# EAGLE design Laser_Teensy4 (EAGLE 9.6.2)

## Sheet 1 of 3
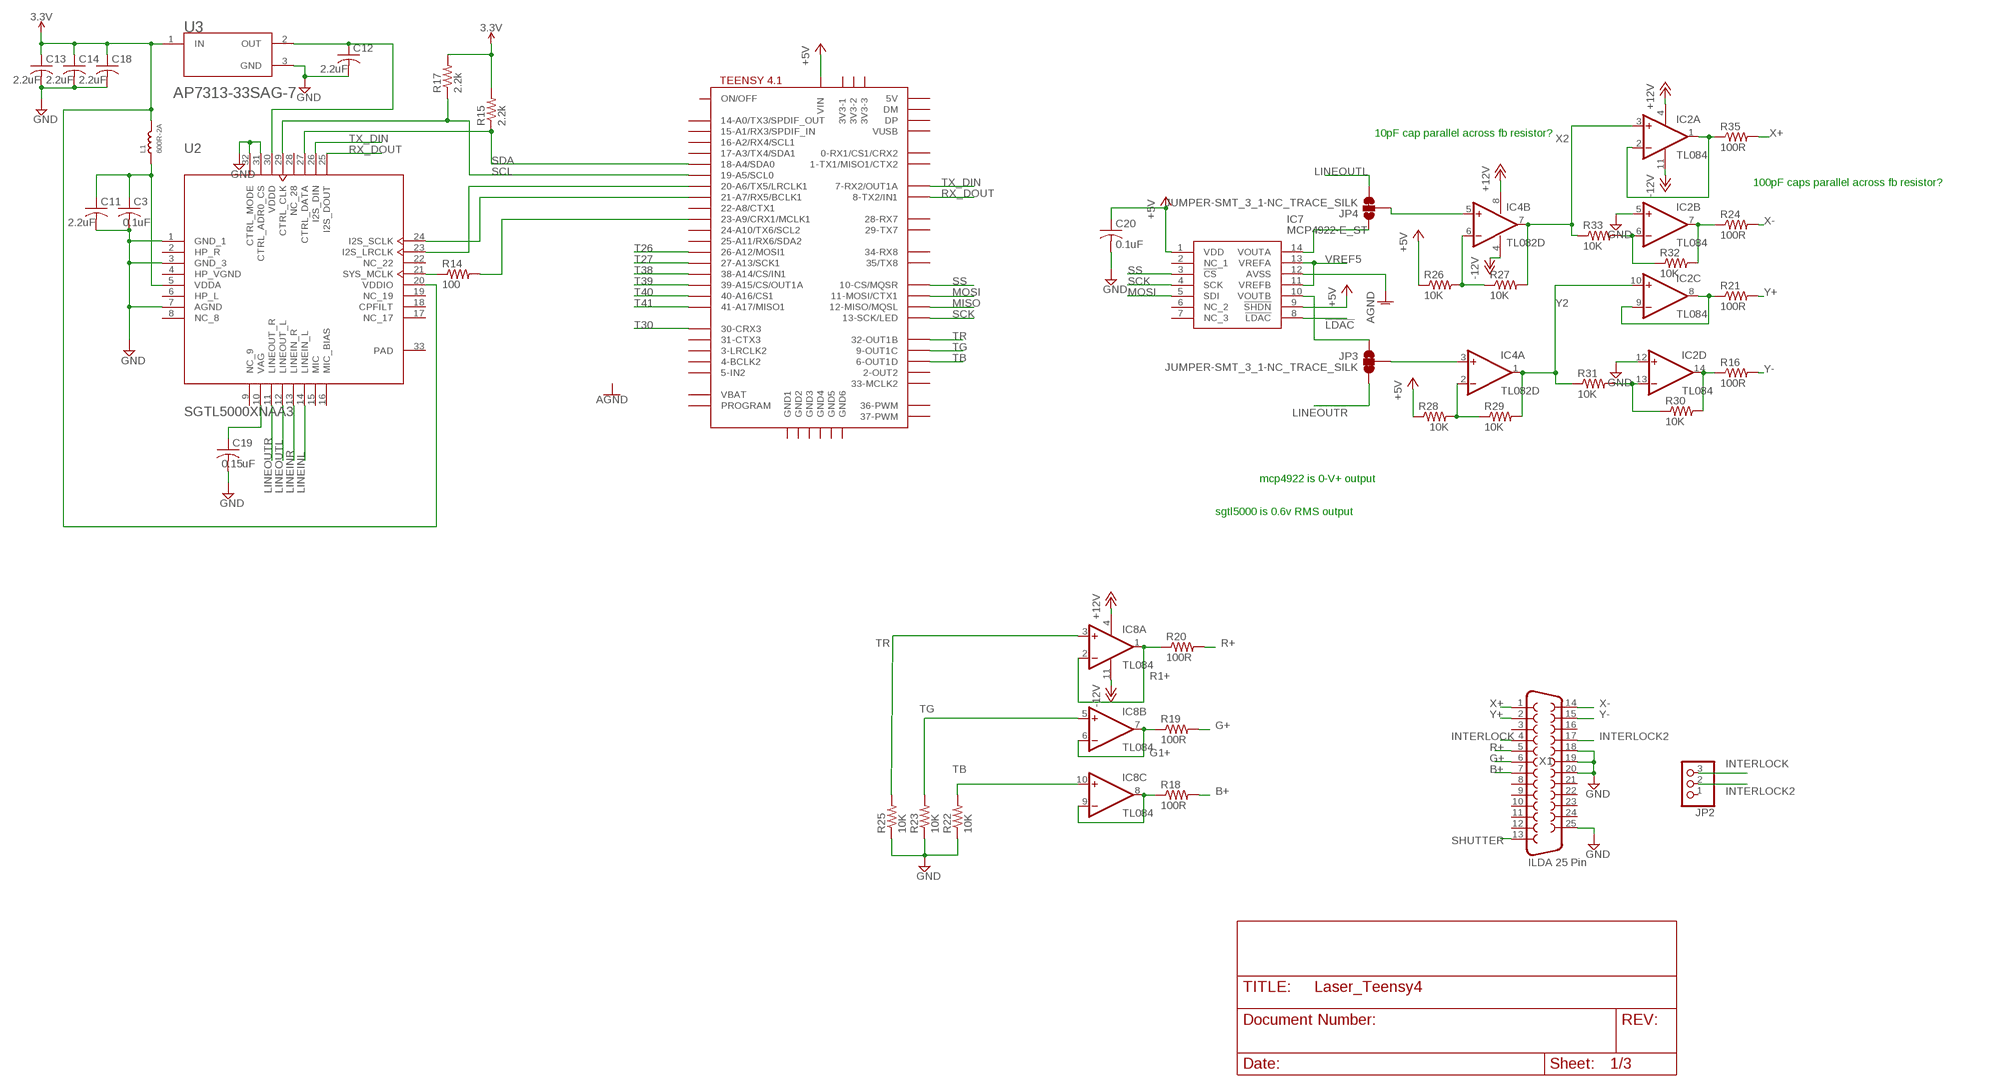
[diagram p0: schematic, sheet 1]

### Parts
C3  0.1uF  RCL_C-USC0603  [RCL_C0603]
C11  2.2uF  RCL_C-USC0603  [RCL_C0603]
C12  2.2uF  RCL_C-USC0603  [RCL_C0603]
C13  2.2uF  RCL_C-USC0603  [RCL_C0603]
C14  2.2uF  RCL_C-USC0603  [RCL_C0603]
C18  2.2uF  RCL_C-USC0603  [RCL_C0603]
C19  0.15uF  RCL_C-USC0603  [RCL_C0603]
C20  0.1uF  C-USC0603  [C0603]
IC2  TL084  [SOIC-14]
IC4  TL082D  [SO08]
IC7  MCP4922-E_ST  [SOP65P638X110-14N]
IC8  TL084  [SOIC-14]
JP2  PINHD-1X3  [1X03]
JP3  JUMPER-SMT_3_1-NC_TRACE_SILK  [SMT-JUMPER_3_1-NC_TRACE_SILK]
JP4  JUMPER-SMT_3_1-NC_TRACE_SILK  [SMT-JUMPER_3_1-NC_TRACE_SILK]
L1  600R-2A  SMD-FERRITE-BEAD-470R-2A(0805)'0805'  [L0805]
R14  100  R-US_R0603  [R0603]
R15  2.2k  R-US_R0603  [R0603]
R16  100R  R-US_R0603  [R0603]
R17  2.2k  R-US_R0603  [R0603]
R18  100R  R-US_R0603  [R0603]
R19  100R  R-US_R0603  [R0603]
R20  100R  R-US_R0603  [R0603]
R21  100R  R-US_R0603  [R0603]
R22  10K  R-US_R0603  [R0603]
R23  10K  R-US_R0603  [R0603]
R24  100R  R-US_R0603  [R0603]
R25  10K  R-US_R0603  [R0603]
R26  10K  R-US_R0603  [R0603]
R27  10K  R-US_R0603  [R0603]
R28  10K  R-US_R0603  [R0603]
R29  10K  R-US_R0603  [R0603]
R30  10K  R-US_R0603  [R0603]
R31  10K  R-US_R0603  [R0603]
R32  10K  R-US_R0603  [R0603]
R33  10K  R-US_R0603  [R0603]
R35  100R  R-US_R0603  [R0603]
U2  SGTL5000XNAA3  [QFN-32]
U3  DIODES_INC_AP7313-33SAG-7DIODES_INC_AP7313-33SAG-7_0_3  [DIODES_INC_AP7313-33SAG-7_3]
U$2  TEENSY41-E  [TENNSY41-E]
X1  ILDA 25 Pin  F25D  [F25D]

### Nets
3.3V [+3V3]: C13.1 C14.1 C18.1 L1.2 R15.2 R17.2 U2.20(VDDIO) U3.1(IN) ; also sheet 2
!LDAC: IC7.8(!LDAC)
+5V [power]: C20.1 IC7.1(VDD) IC7.9(!SHDN) R26.1 R28.1 U$2.VIN ; also sheet 3
+12V [power]: IC2.4(A:V+) IC4.8(P:V+) IC8.4(A:V+) ; also sheet 3
-12V [power]: IC2.11(A:V-) IC4.4(P:V-) IC8.11(A:V-) ; also sheet 3
AGND: IC7.12(AVSS) ; also sheet 3
B1+1: IC8.8(C:OUT) IC8.9(C:-IN) R18.1
B+: R18.2 X1.7
G1+: IC8.6(B:-IN) IC8.7(B:OUT) R19.1
G+: R19.2 X1.6
GND: C3.2 C11.2 C12.2 C13.2 C14.2 C18.2 C19.2 C20.2 IC2.5(B:+IN) IC2.12(D:+IN) R22.1 R23.1 R25.1 U2.1(GND_1) U2.3(GND_3) U2.7(AGND) U2.31(CTRL_ADR0_CS) U2.32(CTRL_MODE) U3.3(GND) X1.18 X1.19 X1.20 X1.25 ; also sheet 2,3
INTERLOCK: JP2.3 X1.4
INTERLOCK2: JP2.2 X1.17
LINEINL: U2.14(LINEIN_L)
LINEINR: U2.13(LINEIN_R)
LINEOUTL: JP4.3 U2.12(LINEOUT_L)
LINEOUTR: JP3.3 U2.11(LINEOUT_R)
MISO: U$2.12-MISO/MQSL
MOSI: IC7.5(SDI) U$2.11-MOSI/CTX1
N$1: IC7.14(VOUTA) JP4.1
N$2: IC7.10(VOUTB) JP3.1
N$9: C19.1 U2.10(VAG)
N$11: R14.2 U$2.23-A9/CRX1/MCLK1
N$12: C3.1 C11.1 L1.1 U2.5(VDDA)
N$13: U2.24(I2S_SCLK) U$2.21-A7/RX5/BCLK1
N$14: U2.23(I2S_LRCLK) U$2.20-A6/TX5/LRCLK1
N$15: R14.1 U2.21(SYS_MCLK)
N$16: C12.1 U2.30(VDDD) U3.2(OUT)
N$17: IC4.3(A:+IN) JP3.2
N$18: IC4.5(B:+IN) JP4.2
N$30: IC4.6(B:-IN) R26.2 R27.1
N$31: IC4.2(A:-IN) R28.2 R29.1
N$35: IC2.6(B:-IN) R32.1 R33.2
N$36: IC2.13(D:-IN) R30.1 R31.2
R1+: IC8.1(A:OUT) IC8.2(A:-IN) R20.1
R+: R20.2 X1.5
RX_DOUT: U2.25(I2S_DOUT) U$2.8-TX2/IN1
SCK: IC7.4(SCK) U$2.13-SCK/LED
SCL: R17.1 U2.29(CTRL_CLK) U$2.19-A5/SCL0
SDA: R15.1 U2.27(CTRL_DATA) U$2.18-A4/SDA0
SHUTTER: X1.13
SS: IC7.3(!CS) U$2.10-CS\MQSR(10-CS/MQSR)
T26: U$2.26-A12/MOSI1 ; also sheet 2
T27: U$2.27-A13/SCK1 ; also sheet 2
T30: U$2.30-CRX3 ; also sheet 2
T38: U$2.38-A14/CS/IN1 ; also sheet 2
T39: U$2.39-A15/CS/OUT1A ; also sheet 2
T40: U$2.40-A16/CS1 ; also sheet 2
T41: U$2.41-A17/MISO1 ; also sheet 2
TB: IC8.10(C:+IN) R22.2 U$2.6-OUT1D
TG: IC8.5(B:+IN) R23.2 U$2.9-OUT1C
TR: IC8.3(A:+IN) R25.2 U$2.32-OUT1B
TX_DIN: U2.26(I2S_DIN) U$2.7-RX2/OUT1A
VREF5 [power]: IC7.11(VREFB) IC7.13(VREFA) ; also sheet 3
X1+: IC2.1(A:OUT) IC2.2(A:-IN) R35.1
X1-: IC2.7(B:OUT) R24.1 R32.2
X2: IC2.3(A:+IN) IC4.7(B:OUT) R27.2 R33.1
X+: R35.2 X1.1
X-: R24.2 X1.14
Y1+: IC2.8(C:OUT) IC2.9(C:-IN) R21.1
Y1-: IC2.14(D:OUT) R16.1 R30.2
Y2: IC2.10(C:+IN) IC4.1(A:OUT) R29.2 R31.1
Y+: R21.2 X1.2
Y-: R16.2 X1.15
Unconnected: IC7.2(NC_1) IC7.6(NC_2) IC7.7(NC_3) IC8.12(D:+IN) IC8.13(D:-IN) IC8.14(D:OUT) JP2.1 U2.2(HP_R) U2.6(HP_L) U2.8(NC_8) U2.9(NC_9) U2.15(MIC) U2.16(MIC_BIAS) U2.17(NC_17) U2.18(CPFILT) U2.19(NC_19) U2.22(NC_22) U2.28(NC_28) U$2.0-RX1/CS1/CRX2 U$2.1-TX1/MISO1/CTX2 U$2.2-OUT2 U$2.3-LRCLK2 U$2.3V3-1 U$2.3V3-2 U$2.3V3-3 U$2.4-BCLK2 U$2.5-IN2 U$2.14-A0/TX3/SPDIF_OUT U$2.15-A1/RX3/SPDIF_IN U$2.16-A2/RX4/SCL1 U$2.17-A3/TX4/SDA1 U$2.22-A8/CTX1 U$2.24-A10/TX6/SCL2 U$2.25-A11/RX6/SDA2 U$2.28-RX7 U$2.29-TX7 U$2.31-CTX3 U$2.33-MCLK2 U$2.34-RX8 U$2.35-TX8(35/TX8) U$2.36-PWM U$2.37-PWM U$2.+5V(5V) U$2.DM U$2.DP U$2.GND1 U$2.GND2 U$2.GND3 U$2.GND4 U$2.GND5 U$2.GND6 U$2.ON/OFF U$2.PROGRAM U$2.VBAT U$2.VUSB X1.3 X1.8 X1.9 X1.10 X1.11 X1.12 X1.16 X1.21 X1.22 X1.23 X1.24

### Notes on the sheet
- 10pF cap parallel across fb resistor?
- 100pF caps parallel across fb resistor?
- mcp4922 is 0-V+ output
- sgtl5000 is 0.6v RMS output

## Sheet 2 of 3
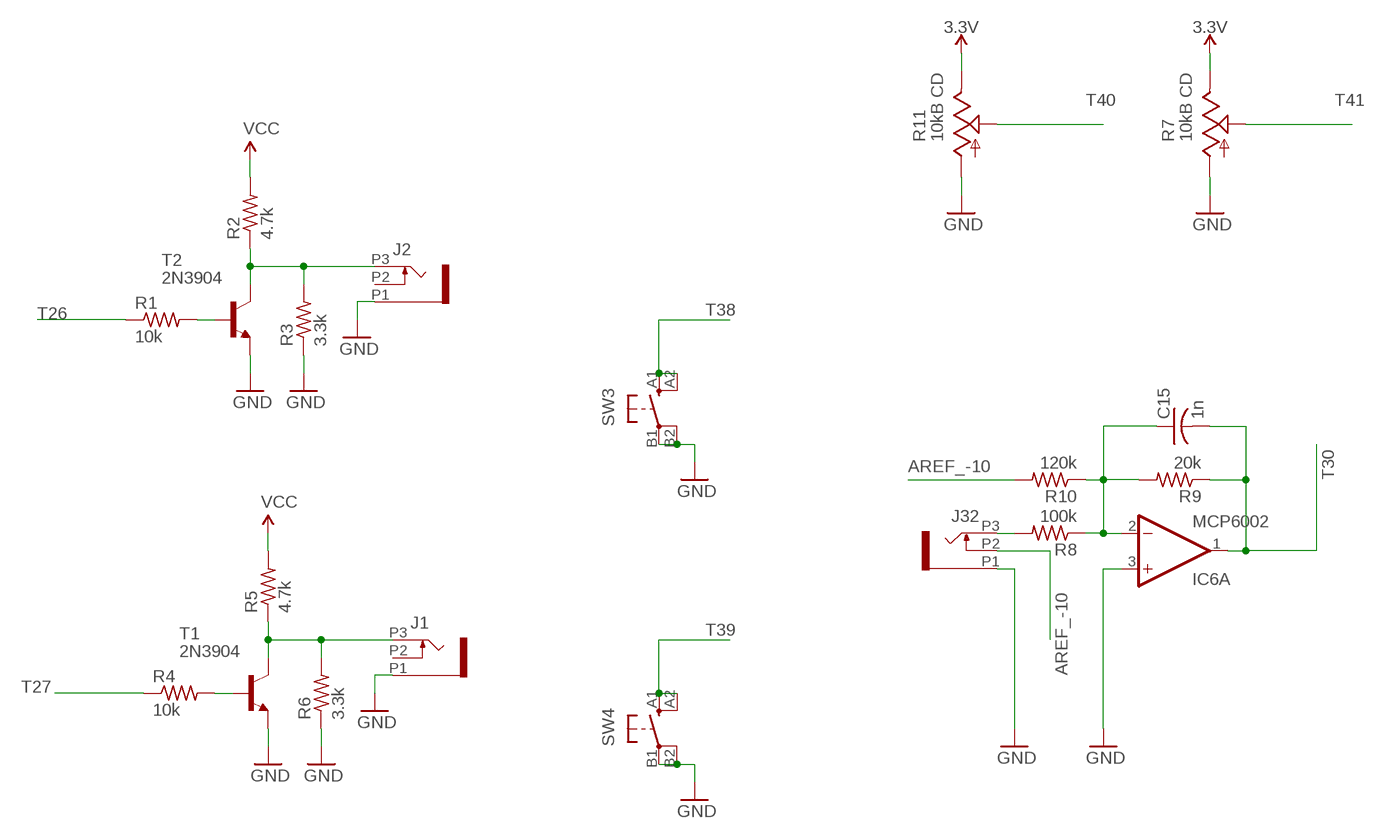
[diagram p1: schematic, sheet 2]

### Parts
C15  1n  C-US050-025X075  [C050-025X075]
IC6  MCP6002  TL072D  [SO08]
J1  PJ301_THONKICONN6  [WQP_PJ_301M6]
J2  PJ301_THONKICONN6  [WQP_PJ_301M6]
J32  PJ301_THONKICONN6  [WQP_PJ_301M6]
R1  10k  R-US_0204/7  [0204/7]
R2  4.7k  R-US_0204/7  [0204/7]
R3  3.3k  R-US_0204/7  [0204/7]
R4  10k  R-US_0204/7  [0204/7]
R5  4.7k  R-US_0204/7  [0204/7]
R6  3.3k  R-US_0204/7  [0204/7]
R7  10kB CD  POT_USVERTICAL_PS  [ALPS_POT_VERTICAL_PS]
R8  100k  R-US_0204/7  [0204/7]
R9  20k  R-US_0204/7  [0204/7]
R10  120k  R-US_0204/7  [0204/7]
R11  10kB CD  POT_USVERTICAL_PS  [ALPS_POT_VERTICAL_PS]
SW3  D6R  [D6R]
SW4  D6R  [D6R]
T1  2N3904  [TO92]
T2  2N3904  [TO92]

### Nets
3.3V [+3V3]: R7.P$1(E) R11.P$1(E) ; also sheet 1
AREF_-10 [-10V]: J32.P2 R10.2
GND: IC6.3(A:+IN) J1.P1 J2.P1 J32.P1 R3.1 R6.1 R7.P$3(A) R11.P$3(A) SW3.B1(P) SW3.B2(P1) SW4.B1(P) SW4.B2(P1) T1.3(E) T2.3(E) ; also sheet 1,3
N$3: R1.2 T2.2(B)
N$4: R4.2 T1.2(B)
N$5: J1.P3 R5.1 R6.2 T1.1(C)
N$6: C15.1 IC6.2(A:-IN) R8.1 R9.2 R10.1
N$20: J2.P3 R2.1 R3.2 T2.1(C)
N$34: J32.P3 R8.2
T26: R1.1 ; also sheet 1
T27: R4.1 ; also sheet 1
T30: C15.2 IC6.1(A:OUT) R9.1 ; also sheet 1
T38: SW3.A1(S) SW3.A2(S1) ; also sheet 1
T39: SW4.A1(S) SW4.A2(S1) ; also sheet 1
T40: R11.P$2(S) ; also sheet 1
T41: R7.P$2(S) ; also sheet 1
VCC [VCC]: R2.2 R5.2
Unconnected: IC6.5(B:+IN) IC6.6(B:-IN) IC6.7(B:OUT) J1.P2 J2.P2

## Sheet 3 of 3
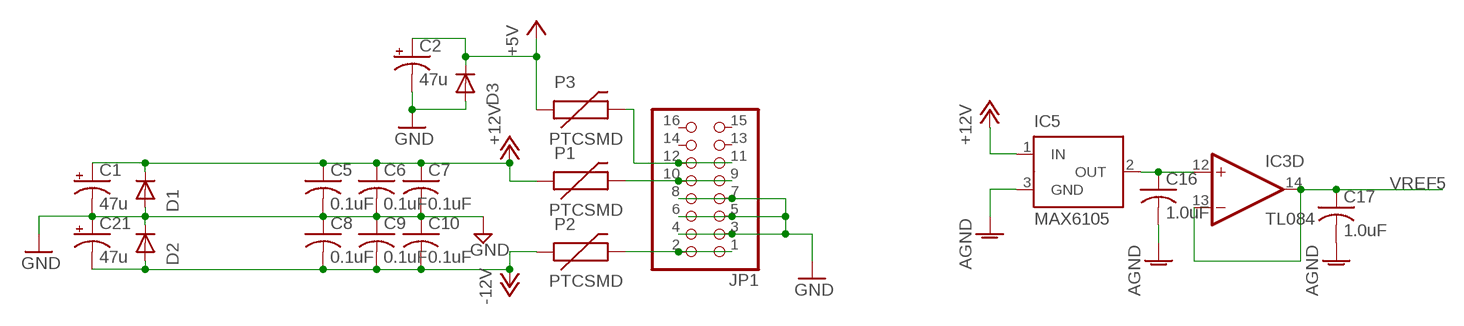
[diagram p2: schematic, sheet 3]

### Parts
C1  47u  CPOL-USD  [PANASONIC_D]
C2  47u  CPOL-USD  [PANASONIC_D]
C5  0.1uF  C-USC0603  [C0603]
C6  0.1uF  C-USC0603  [C0603]
C7  0.1uF  C-USC0603  [C0603]
C8  0.1uF  C-USC0603  [C0603]
C9  0.1uF  C-USC0603  [C0603]
C10  0.1uF  C-USC0603  [C0603]
C16  1.0uF  C-US025-024X044  [C025-024X044]
C17  1.0uF  C-US025-024X044  [C025-024X044]
C21  47u  CPOL-USD  [PANASONIC_D]
D1  1N5819HW  DIODE-SOD123  [SOD123]
D2  1N5819HW  DIODE-SOD123  [SOD123]
D3  1N5819HW  DIODE-SOD123  [SOD123]
IC3  TL084  [SOIC-14]
IC5  MAX6105  MAX6520  [SOT23]
JP1  PINHD-2X8  [2X08]
P1  PTCSMD  [PTC-1206]
P2  PTCSMD  [PTC-1206]
P3  PTCSMD  [PTC-1206]

### Nets
+5V [power]: C2.+ D3.C P3.1 ; also sheet 1
+12V [power]: C1.+ C5.1 C6.1 C7.1 D1.C IC5.1(IN) P1.1 ; also sheet 1
-12V [power]: C8.2 C9.2 C10.2 C21.- D2.A P2.1 ; also sheet 1
AGND: C16.2 C17.2 IC5.3(GND) ; also sheet 1
GND: C1.- C2.- C5.2 C6.2 C7.2 C8.1 C9.1 C10.1 C21.+ D1.A D2.C D3.A JP1.3 JP1.4 JP1.5 JP1.6 JP1.7 JP1.8 ; also sheet 1,2
N$7: JP1.1 JP1.2 P2.2
N$8: JP1.9 JP1.10 P1.2
N$10: JP1.11 JP1.12 P3.2
N$25: C16.1 IC3.12(D:+IN) IC5.2(OUT)
VREF5 [power]: C17.1 IC3.13(D:-IN) IC3.14(D:OUT) ; also sheet 1
Unconnected: IC3.1(A:OUT) IC3.2(A:-IN) IC3.3(A:+IN) IC3.5(B:+IN) IC3.6(B:-IN) IC3.7(B:OUT) IC3.8(C:OUT) IC3.9(C:-IN) IC3.10(C:+IN) JP1.13 JP1.14 JP1.15 JP1.16

## Power pins joined to a net without a drawn wire
HP_VGND: U2.4(HP_VGND)
PAD: U2.33(PAD)
V+: IC3.4(A:V+) IC6.8(P:V+)
V-: IC3.11(A:V-) IC6.4(P:V-)

## Library data of the parts
C1 C2 C21 = rcl:CPOL-US: POLARIZED CAPACITOR, American symbol
C3 C11-C14 C18 C19 = Freak_Select_1.01:RCL_C-US: CAPACITOR, American symbol; SPICEPREFIX: C
C5-C10 C16 C17 C20 = adafruit:C-US: CAPACITOR, American symbol
C15 = rcl:C-US: CAPACITOR, American symbol; SPICEPREFIX: C
D1-D3 = diode:DIODE-: DIODE
IC2 IC3 IC8 = favreau:TL084: Texas Instruments TL084 JFET General Purpose Op-Amp
IC4 = linear:TL082: OP AMP
IC5 = maxim:MAX6520: 1.2V Voltage Reference 50ppm/°C, SOT23, 3-Terminal Source: http://datasheets.maxim-ic.com/en/ds/MAX6520.pdf
IC6 = linear:TL072: OP AMP
IC7 = SamacSys_Parts:MCP4922-E_ST: Microchip MCP4922-E/ST, 2-channel 12 bit Serial DAC, 14-Pin TSSOP Source: Datasheet <http://componentsearchengine.com/Datasheets/3/MCP4922-E_ST.pdf>; ARROW_PART_NUMBER: MCP4922-E/ST; ARROW_PRICE-STOCK: https://www.arrow.com/en/products/mcp4922-est/microchip-technology; DESCRIPTION: Microchip MCP4922-E/ST, 2-channel 12 bit Serial DAC, 14-Pin TSSOP; HEIGHT: 1.1mm; MANUFACTURER_NAME: Microchip; MANUFACTURER_PART_NUMBER: MCP4922-E/ST; MOUSER_PART_NUMBER: 579-MCP4922-E/ST; MOUSER_PRICE-STOCK: https://www.mouser.co.uk/ProductDetail/Microchip-Technology/MCP4922-E-ST?qs=iRhCjdSJZe6gRerFwLixKQ%3D%3D
J1 J2 J32 = og-pj301_variations:PJ301_THONKICONN
JP1 = pinhead:PINHD-2X8: PIN HEADER
JP2 = pinhead:PINHD-1X3: PIN HEADER
JP3 JP4 = SparkFun-Jumpers:JUMPER-SMT_3_1-NC_TRACE: Normally closed trace jumper (1 of 2 connections) This jumper has a trace between two pads so it's normally closed (NC). The other connection is normally open (NO). Use a razor knife to open the connection. For best results follow the IPC guidelines for cutting traces: Cutout at least 0.063 mm (0.005 in). Remove all loose material to clean up the cut area. Seal the cut with an approved epoxy. Reapply solder to reclose the connection, or to close the NO connection.
L1 = OPL_Ferrite_and_Magnetic_Bead:SMD-FERRITE-BEAD-470R-2A(0805): 303030008; MPN: WLB2012-471T20; VALUE: 470R-2A
P1-P3 = SparkFun:PTC: Resettable Fuse PTC Resettable Fuse. Spark Fun Electronics SKU : COM-08357
R1-R6 R8-R10 = rcl:R-US_: RESISTOR, American symbol; SPICEPREFIX: R
R7 R11 = pot-alps:POT_US
R14-R33 R35 = resistor:R-US_: RESISTOR, American symbol
SW3 SW4 = og-switch:D6R: C&K D6R
T1 T2 = transistor:2N3904: NPN TRANSISTOR
U2 = IC:SGTL5000XNAA3: IC AUDIO CODEC STEREO 32-QFN Manufacturer's datasheet <http://cache.freescale.com/files/analog/doc/data_sheet/SGTL5000.pdf>; CREATED_BY: PCBLayout.com; DIGIKEY_PART_NUMBER: SGTL5000XNAA3-ND; MANUFACTURER: NXP USA Inc.; MPN: SGTL5000XNAA3; PACKAGE: 32-QFN-EP
U3 = Diodes Inc. - AP7313-33SAG-7:DIODES_INC_AP7313-33SAG-7: IC REG LINEAR 3.3V 150MA SOT23-3; ACCURACY_PERCENTAGE: 2%; AMBIENT_TEMPERATURE_RANGE_HIGH: +85°C; AMBIENT_TEMPERATURE_RANGE_LOW: -40°C; AUTOMOTIVE: No; CENTROID_NOT_SPECIFIED: No; DATASHEET: https://www.diodes.com/assets/Datasheets/AP7313.pdf; DEVICE_CLASS_L1: Integrated Circuits (ICs); DEVICE_CLASS_L2: Power Management ICs; DEVICE_CLASS_L3: Voltage Regulators - Linear; DIGIKEY_DESCRIPTION: IC REG LINEAR 3.3V 150MA SOT23-3; DIGIKEY_PART_NUMBER: AP7313-33SAG-7DICT-ND; DROPOUT_VOLTAGE: 150mV; FOOTPRINT_PARAMETERS_1: {"fp_type":"SOT23","params":{"N":{"default":"3","long name":"Number of leads","type":"multichoice","short name":"N"},"A":{"nom":1024999,"long name":"Height","min":903000,"max":1100000,"short name":"A","type":"measurement"},"A1":{"nom":50000,"long name":"Package clearance","min":13000,"max":100000,"short name":"A1","type":"measurement"},"A2":{"nom":975000,"long name":"Package height","min":890000,"max":1000000,"short name":"A2","type":"measurement"},"D":{"nom":2900000,"long name":"Package length","min":2800000,"max":3000000,"short name":"D","type":"measurement"},"E":{"nom":2400000,"long name":"Width /w leads","min":2300000,"max":2500000,"short name":"E","type":"measurement"},"E1":{"nom":1300000,"long name":"Package width","min":1200000,"max":1400000,"short name":"E1","type":"measurement"},"B":{"nom":400000,"long name":"Lead width","min":370000,"max":510000,"short name":"B","type":"measurement"},"C":{"nom":110000,"long name":"Lead thickness","min":85000,"max":150000,"short name":"C","type":"measurement"},"L":{"nom":400000,"long name":"Lead foot length","min":250000,"max":550000,"short name":"L","type":"measurement"},"e":{"nom":915000,"long name":"Lead pitch","min":null,"max":null,"short name":"e","type":"measurement"},"PHI":{"nom":false,"long name":"Lead angle","min":0,"max":8,"short name":"PHI","type":"measurement"},"offset x":{"nom":0,"long name":"X Center offset","min":null,"max":null,"short name":"offset x","type":"measurement"},"offset y":{"nom":0,"long name":"Y Center offset","min":null,"max":null,"short name":"offset y","type":"measurement"},"LS":{"default":"Rounded rectangle","long name":"Land shape","type":"multichoice","short name":"LS"},"LS1":{"default":"Rectangle","long name":"Land shape (Pin 1)","type":"multichoice","short name":"LS1"},"solder toe":{"nom":550000,"long name":"Solder fillet (toe)","min":null,"max":null,"short name":"solder toe","type":"fixedmeasurement"},"solder heel":{"nom":450000,"long name":"Solder fillet (heel)","min":null,"max":null,"short name":"solder heel","type":"fixedmeasurement"},"solder side":{"nom":50000,"long name":"Solder fillet (side)","min":null,"max":null,"short name":"solder side","type":"fixedmeasurement"},"courtyard":{"nom":500000,"long name":"Courtyard","min":null,"max":null,"short name":"courtyard","type":"fixedmeasurement"},"SF":{"default":"A","long name":"Packing level","type":"multichoiceparent","short name":"SF","help":"http://support.upverter.com/customer/portal/articles/978783-what-is-a-footprint-packing-level","children":["solder toe","solder heel","solder side","courtyard"]}}}; FOOTPRINT_PARAMETERS_2: {"fp_type":"SOT23","params":{"N":{"default":"3","long name":"Number of leads","type":"multichoice","short name":"N"},"A":{"nom":1024999,"long name":"Height","min":903000,"max":1100000,"short name":"A","type":"measurement"},"A1":{"nom":50000,"long name":"Package clearance","min":13000,"max":100000,"short name":"A1","type":"measurement"},"A2":{"nom":975000,"long name":"Package height","min":890000,"max":1000000,"short name":"A2","type":"measurement"},"D":{"nom":2900000,"long name":"Package length","min":2800000,"max":3000000,"short name":"D","type":"measurement"},"E":{"nom":2400000,"long name":"Width /w leads","min":2300000,"max":2500000,"short name":"E","type":"measurement"},"E1":{"nom":1300000,"long name":"Package width","min":1200000,"max":1400000,"short name":"E1","type":"measurement"},"B":{"nom":400000,"long name":"Lead width","min":370000,"max":510000,"short name":"B","type":"measurement"},"C":{"nom":110000,"long name":"Lead thickness","min":85000,"max":150000,"short name":"C","type":"measurement"},"L":{"nom":400000,"long name":"Lead foot length","min":250000,"max":550000,"short name":"L","type":"measurement"},"e":{"nom":915000,"long name":"Lead pitch","min":null,"max":null,"short name":"e","type":"measurement"},"PHI":{"nom":false,"long name":"Lead angle","min":0,"max":8,"short name":"PHI","type":"measurement"},"offset x":{"nom":0,"long name":"X Center offset","min":null,"max":null,"short name":"offset x","type":"measurement"},"offset y":{"nom":0,"long name":"Y Center offset","min":null,"max":null,"short name":"offset y","type":"measurement"},"LS":{"default":"Rounded rectangle","long name":"Land shape","type":"multichoice","short name":"LS"},"LS1":{"default":"Rectangle","long name":"Land shape (Pin 1)","type":"multichoice","short name":"LS1"},"solder toe":{"nom":350000,"long name":"Solder fillet (toe)","min":null,"max":null,"short name":"solder toe","type":"fixedmeasurement"},"solder heel":{"nom":350000,"long name":"Solder fillet (heel)","min":null,"max":null,"short name":"solder heel","type":"fixedmeasurement"},"solder side":{"nom":30000,"long name":"Solder fillet (side)","min":null,"max":null,"short name":"solder side","type":"fixedmeasurement"},"courtyard":{"nom":250000,"long name":"Courtyard","min":null,"max":null,"short name":"courtyard","type":"fixedmeasurement"},"SF":{"default":"B","long name":"Packing level","type":"multichoiceparent","short name":"SF","help":"http://support.upverter.com/customer/portal/articles/978783-what-is-a-footprint-packing-level","children":["solder toe","solder heel","solder side","courtyard"]}}}; FOOTPRINT_PARAMETERS_3: {"fp_type":"SOT23","params":{"N":{"default":"3","long name":"Number of leads","type":"multichoice","short name":"N"},"A":{"nom":1024999,"long name":"Height","min":903000,"max":1100000,"short name":"A","type":"measurement"},"A1":{"nom":50000,"long name":"Package clearance","min":13000,"max":100000,"short name":"A1","type":"measurement"},"A2":{"nom":975000,"long name":"Package height","min":890000,"max":1000000,"short name":"A2","type":"measurement"},"D":{"nom":2900000,"long name":"Package length","min":2800000,"max":3000000,"short name":"D","type":"measurement"},"E":{"nom":2400000,"long name":"Width /w leads","min":2300000,"max":2500000,"short name":"E","type":"measurement"},"E1":{"nom":1300000,"long name":"Package width","min":1200000,"max":1400000,"short name":"E1","type":"measurement"},"B":{"nom":400000,"long name":"Lead width","min":370000,"max":510000,"short name":"B","type":"measurement"},"C":{"nom":110000,"long name":"Lead thickness","min":85000,"max":150000,"short name":"C","type":"measurement"},"L":{"nom":400000,"long name":"Lead foot length","min":250000,"max":550000,"short name":"L","type":"measurement"},"e":{"nom":915000,"long name":"Lead pitch","min":null,"max":null,"short name":"e","type":"measurement"},"PHI":{"nom":false,"long name":"Lead angle","min":0,"max":8,"short name":"PHI","type":"measurement"},"offset x":{"nom":0,"long name":"X Center offset","min":null,"max":null,"short name":"offset x","type":"measurement"},"offset y":{"nom":0,"long name":"Y Center offset","min":null,"max":null,"short name":"offset y","type":"measurement"},"LS":{"default":"Rounded rectangle","long name":"Land shape","type":"multichoice","short name":"LS"},"LS1":{"default":"Rectangle","long name":"Land shape (Pin 1)","type":"multichoice","short name":"LS1"},"solder toe":{"nom":150000,"long name":"Solder fillet (toe)","min":null,"max":null,"short name":"solder toe","type":"fixedmeasurement"},"solder heel":{"nom":250000,"long name":"Solder fillet (heel)","min":null,"max":null,"short name":"solder heel","type":"fixedmeasurement"},"solder side":{"nom":10000,"long name":"Solder fillet (side)","min":null,"max":null,"short name":"solder side","type":"fixedmeasurement"},"courtyard":{"nom":100000,"long name":"Courtyard","min":null,"max":null,"short name":"courtyard","type":"fixedmeasurement"},"SF":{"default":"C","long name":"Packing level","type":"multichoiceparent","short name":"SF","help":"http://support.upverter.com/customer/portal/articles/978783-what-is-a-footprint-packing-level","children":["solder toe","solder heel","solder side","courtyard"]}}}; FOOTPRINT_URL: https://www.diodes.com/assets/Package-Files/SOT23.pdf; FOOTPRINT_VARIANT_NAME_0: Recommended_Land_Pattern; FOOTPRINT_VARIANT_NAME_1: IPC_A; FOOTPRINT_VARIANT_NAME_2: IPC_B; FOOTPRINT_VARIANT_NAME_3: IPC_C; HEIGHT: 1.1mm; LEAD_FREE: Yes; MAX_JUNCTION_TEMP: +125°C; MAX_POWER_DISSIPATION: 600mW; MAX_SUPPLY_VOLTAGE: 6V; MF: Diodes Inc.; MFG_PACKAGE_IDENT: SOT23; MFG_PACKAGE_IDENT_COMPONENT_ID: 395c052727f488cf; MFG_PACKAGE_IDENT_DATE: 01/2017; MFG_PACKAGE_IDENT_REV: 0; MIN_SUPPLY_VOLTAGE: 2V; MOUSER_DESCRIPTION: LDO Voltage Regulators LDO SOT-23 3.3V/150MA; MOUSER_PART_NUMBER: 621-AP7313-33SAG-7; MPN: AP7313-33SAG-7; NOMINAL_SUPPLY_CURRENT: 55-65uA; NUMBER_OF_OUTPUTS: 1; OUTPUT_CURRENT: 150mA; OUTPUT_TYPE: Fixed; OUTPUT_VOLTAGE: 3.3V; PACKAGE: SOT23; PREFIX: U; ROHS: Yes; STANDOFF_HEIGHT: 0.013mm; TEMPERATURE_RANGE_HIGH: +125°C; TEMPERATURE_RANGE_LOW: -40°C; VERIFICATION_VERSION: 0.0.0.3
U$2 = teensy:TEENSY41-E
X1 = SparkFun:F25: D-SUB 25 25 Pin male connector. PCB edge mount for regular PCB thicknesses. This connector will connect directly to the back of a PC parallel port or through a normal DB25 extension cable (M/F). SKU: PRT-08287

## Net classes
0 default: width 0.203 mm, clearance 0.203 mm
1 power: width 0.305 mm, clearance 0.203 mm
2 +3V3: width 0.356 mm, clearance 0.152 mm to class 0, clearance 0.254 mm
3 -10V: width 0.356 mm, clearance 0.152 mm to class 0, clearance 0.254 mm
4 VCC: width 0.457 mm, clearance 0.152 mm to class 0, clearance 0.254 mm

## Board
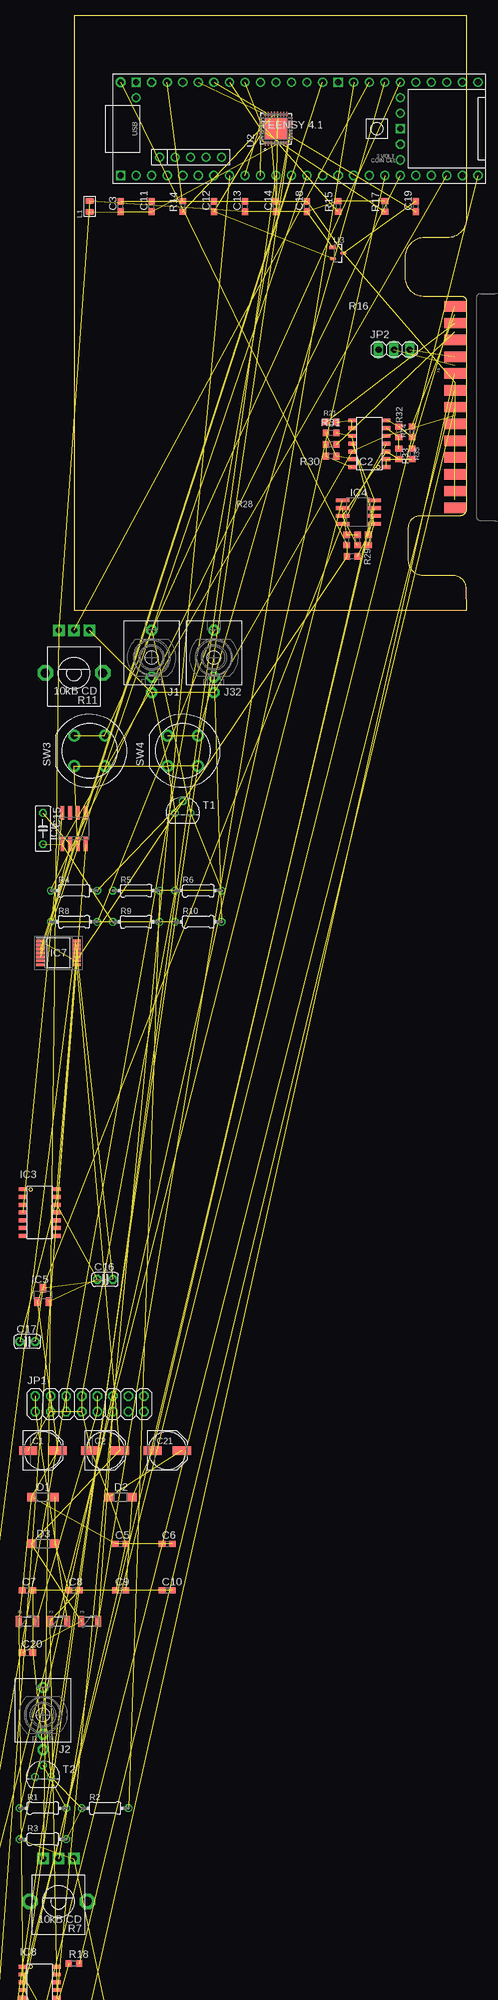
[diagram p3: board, top side]
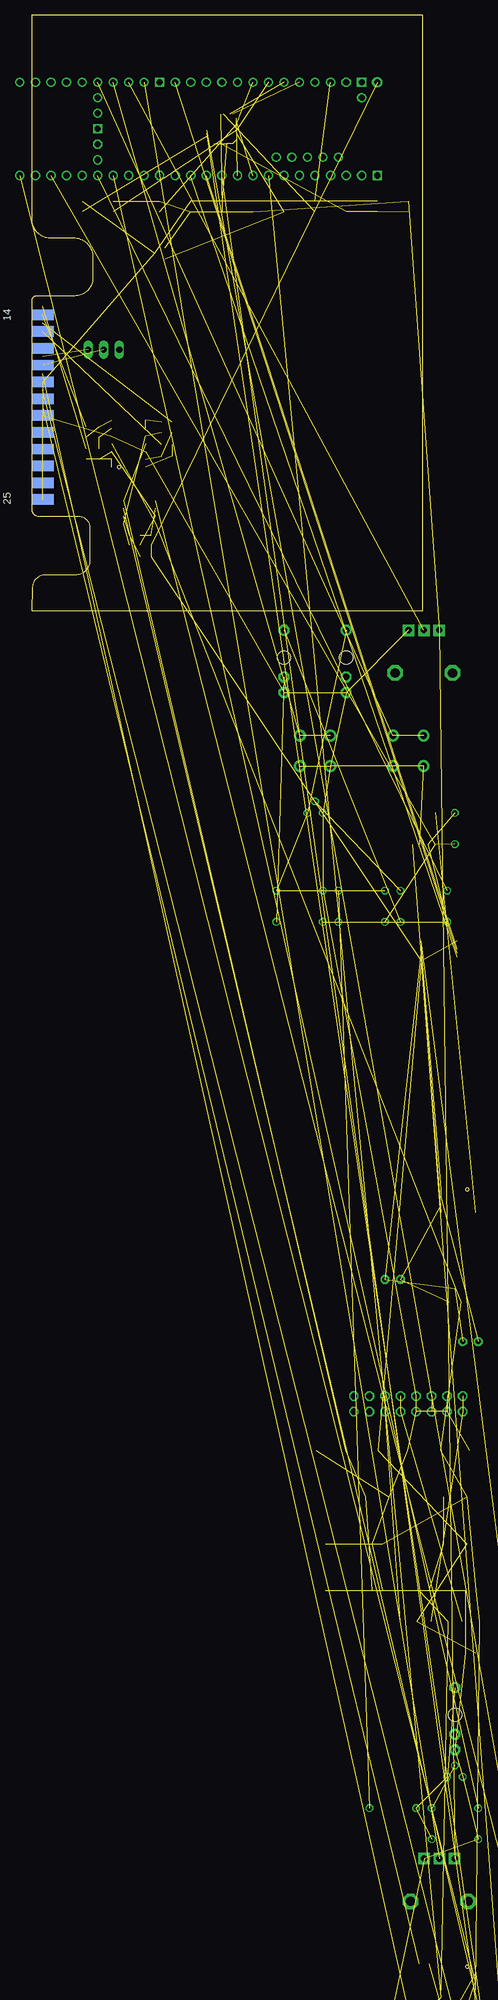
[diagram p4: board, bottom side, seen from below]

Size 71.5 x 319.02 mm. Coordinates in mm from the lower left corner, seen from the top.
Outline: 7.49,319.02 71.5,319.02 71.5,285.74 arc-90 68.47,282.7 64.69,282.7 arc90 61.47,279.48 61.47,276.16 arc90 64.45,273.18 70.63,273.18 arc-90 71.5,272.31 71.5,238.31 arc-90 70.43,237.24 63.92,237.24 arc90 61.98,235.29 61.98,229.97 arc90 64.36,227.58 69.27,227.58 arc-90 71.38,225.48 71.5,221.74 7.49,221.74 7.49,319.02
Copper layers (1*16): Top 0.0356mm / dielectric 1.5011mm / Bottom 0.0356mm
Design rules "LaenPCBOrder": minimum track width 6mil, minimum drill 13mil, track to track 6mil, track to pad 6mil, pad to pad 6mil, via to via 6mil, smd to smd 6mil, copper to edge 15mil, drill to drill 6mil, minimum pad ring 7mil, minimum via ring 7mil, stop-mask expansion 4mil, vias tented up to drill 0mil, thermal gap 10mil

### Footprints (pad centres in the part's own frame; a part is rotated, then mirrored left to right if it is on the bottom)
PANASONIC_D = smd 3 x 1.4: + 2.4,0; - -2.4,0
RCL_C0603 = smd 1.1 x 1: 1 -0.85,0; 2 0.85,0
C0603 = smd 1.1 x 1: 1 -0.85,0; 2 0.85,0
C050-025X075 = drill 0.813 octagon: 1 -2.54,0; 2 2.54,0
C025-024X044 = drill 0.813 pad 1.422 octagon: 1 -1.27,0; 2 1.27,0
SOD123 = smd 1.4 x 1.4: A 1.9,0; C -1.9,0
SOIC-14 = smd 1.27 x 0.635: 1 -0.762,-0.508; 2 -0.762,-1.778; 3 -0.762,-3.048; 4 -0.762,-4.318; 5 -0.762,-5.588; 6 -0.762,-6.858; 7 -0.762,-8.128; 8 4.826,-8.128; 9 4.826,-6.858; 10 4.826,-5.588; 11 4.826,-4.318; 12 4.826,-3.048; 13 4.826,-1.778; 14 4.826,-0.508
SO08 = smd 0.6 x 2.2: 1 -1.905,-2.6; 2 -0.635,-2.6; 3 0.635,-2.6; 4 1.905,-2.6; 5 1.905,2.6; 6 0.635,2.6; 7 -0.635,2.6; 8 -1.905,2.6
SOT23 = smd 1 x 1.4: 1 -0.95,-1.1; 2 0.95,-1.1; 3 0,1.1
SOP65P638X110-14N = smd 1.45 x 0.45: 1 -2.925,1.95; 2 -2.925,1.3; 3 -2.925,0.65; 4 -2.925,0; 5 -2.925,-0.65; 6 -2.925,-1.3; 7 -2.925,-1.95; 8 2.925,-1.95; 9 2.925,-1.3; 10 2.925,-0.65; 11 2.925,0; 12 2.925,0.65; 13 2.925,1.3; 14 2.925,1.95
WQP_PJ_301M6 = drill 1.016 pad 1.778 octagon: P1 0,-5.715; P2 0,-3.175; P3 0,4.445 | hole 2.2: 0,0
2X08 = drill 1.016 octagon: 1 -8.89,-1.27; 2 -8.89,1.27; 3 -6.35,-1.27; 4 -6.35,1.27; 5 -3.81,-1.27; 6 -3.81,1.27; 7 -1.27,-1.27; 8 -1.27,1.27; 9 1.27,-1.27; 10 1.27,1.27; 11 3.81,-1.27; 12 3.81,1.27; 13 6.35,-1.27; 14 6.35,1.27; 15 8.89,-1.27; 16 8.89,1.27
1X03 = drill 1.016 long: 1 -2.54,0; 2 0,0; 3 2.54,0
SMT-JUMPER_3_1-NC_TRACE_SILK = smd 0.635 x 1.27: 1 -1.016,0; 2 0,0; 3 1.016,0
L0805 = smd 1.016 x 1.397: 1 -0.889,0; 2 0.889,0
PTC-1206 = smd 1 x 1.8: 1 -1.4,0; 2 1.4,0
0204/7 = drill 0.813 octagon: 1 -3.81,0; 2 3.81,0
ALPS_POT_VERTICAL_PS = drill 1 pad 1.88 square: P$1 -2.5,7; P$2 0,7; P$3 2.5,7 | drill 1.5 pad 2.54 octagon: P$4 -4.7,0; P$5 4.7,0
R0603 = smd 1 x 1.1: 1 -0.85,0; 2 0.85,0
D6R = drill 1.1 pad 1.93: A1 -2.5,2.5; A2 2.5,2.5; B1 -2.5,-2.5; B2 2.5,-2.5
TO92 = drill 0.813 octagon: 1 1.27,0; 2 0,1.905; 3 -1.27,0
QFN-32 = smd 0.74 x 0.26: 1 -2.395,1.75; 2 -2.395,1.25; 3 -2.395,0.75; 4 -2.395,0.25; 5 -2.395,-0.25; 6 -2.395,-0.75; 7 -2.395,-1.25; 8 -2.395,-1.75; 17 2.395,-1.75; 18 2.395,-1.25; 19 2.395,-0.75; 20 2.395,-0.25; 21 2.395,0.25; 22 2.395,0.75; 23 2.395,1.25; 24 2.395,1.75 | smd 0.26 x 0.74: 9 -1.75,-2.395; 10 -1.25,-2.395; 11 -0.75,-2.395; 12 -0.25,-2.395; 13 0.25,-2.395; 14 0.75,-2.395; 15 1.25,-2.395; 16 1.75,-2.395; 25 1.75,2.395; 26 1.25,2.395; 27 0.75,2.395; 28 0.25,2.395; 29 -0.25,2.395; 30 -0.75,2.395; 31 -1.25,2.395; 32 -1.75,2.395 | smd 3.6 x 3.6: 33 0,0
DIODES_INC_AP7313-33SAG-7_3 = smd 1.059 x 0.547: 1 -0.877,0.915; 2 -0.877,-0.915; 3 0.877,0
TENNSY41-E = drill 1: 0-RX1/CS1/CRX2 -27.94,-7.62; 1-TX1/MISO1/CTX2 -25.4,-7.62; 2-OUT2 -22.86,-7.62; 3-LRCLK2 -20.32,-7.62; 4-BCLK2 -17.78,-7.62; 5-IN2 -15.24,-7.62; 6-OUT1D -12.7,-7.62; 7-RX2/OUT1A -10.16,-7.62; 8-TX2/IN1 -7.62,-7.62; 9-OUT1C -5.08,-7.62; 10-CS\MQSR -2.54,-7.62; 11-MOSI/CTX1 0,-7.62; 12-MISO/MQSL 2.54,-7.62; 13-SCK/LED 2.54,7.62; 14-A0/TX3/SPDIF_OUT 0,7.62; 15-A1/RX3/SPDIF_IN -2.54,7.62; 16-A2/RX4/SCL1 -5.08,7.62; 17-A3/TX4/SDA1 -7.62,7.62; 18-A4/SDA0 -10.16,7.62; 19-A5/SCL0 -12.7,7.62; 20-A6/TX5/LRCLK1 -15.24,7.62; 21-A7/RX5/BCLK1 -17.78,7.62; 22-A8/CTX1 -20.32,7.62; 23-A9/CRX1/MCLK1 -22.86,7.62; 24-A10/TX6/SCL2 7.62,-7.62; 25-A11/RX6/SDA2 10.16,-7.62; 26-A12/MOSI1 12.7,-7.62; 27-A13/SCK1 15.24,-7.62; 28-RX7 17.78,-7.62; 29-TX7 20.32,-7.62; 30-CRX3 22.86,-7.62; 31-CTX3 25.4,-7.62; 32-OUT1B 27.94,-7.62; 33-MCLK2 27.94,7.62; 34-RX8 25.4,7.62; 35-TX8 22.86,7.62; 36-PWM 20.32,7.62; 37-PWM 17.78,7.62; 38-A14/CS/IN1 15.24,7.62; 39-A15/CS/OUT1A 12.7,7.62; 40-A16/CS1 10.16,7.62; 41-A17/MISO1 7.62,7.62; +5V -24.13,-4.62; DM -21.59,-4.62; DP -19.05,-4.62; GND4 -16.51,-4.62; GND5 -13.97,-4.62; ON/OFF 15.24,5.08; PROGRAM 15.24,2.54; VBAT 15.24,-5.08; VUSB -27.94,5.08 | drill 1 octagon: 3V3-1 5.08,-7.62; 3V3-2 15.24,-2.54; 3V3-3 -25.4,7.62 | drill 1 square: GND1 -30.48,-7.62; GND2 15.24,0; GND3 5.08,7.62; GND6 -27.94,7.62 | drill 1 pad 1.676: VIN -30.48,7.62
F25D = smd 1.7 x 3.5: 1 -16.459,-6.045; 2 -13.716,-6.045; 3 -10.973,-6.045; 4 -8.23,-6.045; 5 -5.486,-6.045; 6 -2.743,-6.045; 7 0,-6.045; 8 2.743,-6.045; 9 5.486,-6.045; 10 8.23,-6.045; 11 10.973,-6.045; 12 13.716,-6.045; 13 16.459,-6.045 | smd 1.7 x 3.5 bottom: 14 -15.088,-6.045; 15 -12.344,-6.045; 16 -9.601,-6.045; 17 -6.858,-6.045; 18 -4.115,-6.045; 19 -1.372,-6.045; 20 1.372,-6.045; 21 4.115,-6.045; 22 6.858,-6.045; 23 9.601,-6.045; 24 12.344,-6.045; 25 15.088,-6.045

### Placement (x,y rotation side)
C1  2.29,84.58 0 top
C2  12.45,84.58 0 top
C3  14.99,287.78 90 top
C5  14.99,69.34 0 top
C6  22.61,69.34 0 top
C7  -0.25,61.72 0 top
C8  7.37,61.72 0 top
C9  14.99,61.72 0 top
C10  22.61,61.72 0 top
C11  20.07,287.78 90 top
C12  30.23,287.78 90 top
C13  35.31,287.78 90 top
C14  40.39,287.78 90 top
C15  2.29,186.18 270 top
C16  12.45,112.52 0 top
C17  -0.25,102.36 0 top
C18  45.47,287.78 90 top
C19  63.25,287.78 90 top
C20  -0.25,51.56 0 top
C21  22.61,84.58 0 top
D1  2.29,76.96 0 top
D2  14.99,76.96 0 top
D3  2.29,69.34 0 top
IC2  57.66,244.73 180 top
IC3  -0.25,127.76 0 top
IC4  53.85,237.87 90 top
IC5  2.29,109.98 0 top
IC6  7.37,186.18 0 top
IC7  4.83,165.86 0 top
IC8  -0.25,0.76 0 top
J1  20.07,214.12 0 top
J2  2.29,41.4 0 top
J32  30.23,214.12 0 top
JP1  9.91,92.2 0 top
JP2  59.69,264.41 0 top
JP3  -5.33,-22.1 0 top  (outside the outline)
JP4  -15.49,-22.1 0 top  (outside the outline)
L1  9.91,287.78 90 top
P1  -0.25,56.64 0 top
P2  4.83,56.64 0 top
P3  9.91,56.64 0 top
R1  2.29,26.16 0 top
R2  12.45,26.16 0 top
R3  2.29,21.08 0 top
R4  7.37,176.02 0 top
R5  17.53,176.02 0 top
R6  27.69,176.02 0 top
R7  4.83,10.92 0 top
R8  7.37,170.94 0 top
R9  17.53,170.94 0 top
R10  27.69,170.94 0 top
R11  7.37,211.58 0 top
R14  25.15,287.78 90 top
R15  50.55,287.78 90 top
R16  49.4,248.92 0 top
R17  58.17,287.78 90 top
R18  7.37,0.76 0 top
R19  -0.25,-14.48 0 top  (outside the outline)
R20  7.37,-14.48 0 top  (outside the outline)
R21  49.4,252.6 180 top
R22  14.99,-14.48 0 top  (outside the outline)
R23  -0.25,-22.1 0 top  (outside the outline)
R24  62.61,250.95 90 top
R25  4.83,-22.1 0 top  (outside the outline)
R26  51.94,233.3 90 top
R27  53.72,233.3 270 top
R28  52.83,230.63 0 top
R29  55.5,233.3 270 top
R30  49.4,247.02 180 top
R31  49.4,250.83 180 top
R32  60.45,250.95 90 top
R33  60.45,247.4 90 top
R35  62.61,247.4 90 top
SW3  9.91,198.88 0 top
SW4  25.15,198.88 0 top
T1  25.15,188.72 0 top
T2  2.29,31.24 0 top
U2  40.39,300.48 90 top
U3  50.55,280.16 0 top
U$2  45.47,300.48 0 top
X1  75.69,255.02 270 top

### Tracks (layer width: path | path; a pad name or v marks a point on that pad's centre or on a via)
3.3V  (9 unrouted)
+5V  (8 unrouted)
+12V  (9 unrouted)
-12V  (8 unrouted)
AGND  (3 unrouted)
AREF_-10  (1 unrouted)
B1+1  (2 unrouted)
B+  (1 unrouted)
G1+  (2 unrouted)
G+  (1 unrouted)
GND  (54 unrouted)
  pour Bottom: 6.1,320.8 64.52,320.8 64.52,220.47 6.1,220.47
INTERLOCK  (1 unrouted)
INTERLOCK2  (1 unrouted)
LINEOUTL  (1 unrouted)
LINEOUTR  (1 unrouted)
MOSI  (1 unrouted)
N$1  (1 unrouted)
N$2  (1 unrouted)
N$3  (1 unrouted)
N$4  (1 unrouted)
N$5  (3 unrouted)
N$6  (4 unrouted)
N$7  (2 unrouted)
N$8  (2 unrouted)
N$9  (1 unrouted)
N$10  (2 unrouted)
N$11  (1 unrouted)
N$12  (3 unrouted)
N$13  (1 unrouted)
N$14  (1 unrouted)
N$15  (1 unrouted)
N$16  (2 unrouted)
N$17  (1 unrouted)
N$18  (1 unrouted)
N$20  (3 unrouted)
N$25  (2 unrouted)
N$30  (2 unrouted)
N$31  (2 unrouted)
N$34  (1 unrouted)
N$35  (2 unrouted)
N$36  (2 unrouted)
R1+  (2 unrouted)
R+  (1 unrouted)
RX_DOUT  (1 unrouted)
SCK  (1 unrouted)
SCL  (2 unrouted)
SDA  (2 unrouted)
SS  (1 unrouted)
T26  (1 unrouted)
T27  (1 unrouted)
T30  (3 unrouted)
T38  (2 unrouted)
T39  (2 unrouted)
T40  (1 unrouted)
T41  (1 unrouted)
TB  (2 unrouted)
TG  (2 unrouted)
TR  (2 unrouted)
TX_DIN  (1 unrouted)
V+  (1 unrouted)
V-  (1 unrouted)
VCC  (1 unrouted)
VREF5  (4 unrouted)
X1+  (2 unrouted)
X1-  (2 unrouted)
X2  (3 unrouted)
X+  (1 unrouted)
X-  (1 unrouted)
Y1+  (2 unrouted)
Y1-  (2 unrouted)
Y2  (3 unrouted)
Y+  (1 unrouted)
Y-  (1 unrouted)

### Text on the board
TallParts: USB | ISP | PWR
ArduinoHoles: 3.2mm | 2.2mm | 3.2mm